# Altium schematic sheet 1_Comb_Generator_Sch.SchDoc
size A4; SheetNumber: 2; SheetTotal: 4; SPICEModelCacheYMJCRCOB: <root> / <DocumentId>YMJCRCOB</DocumentId> / </root>
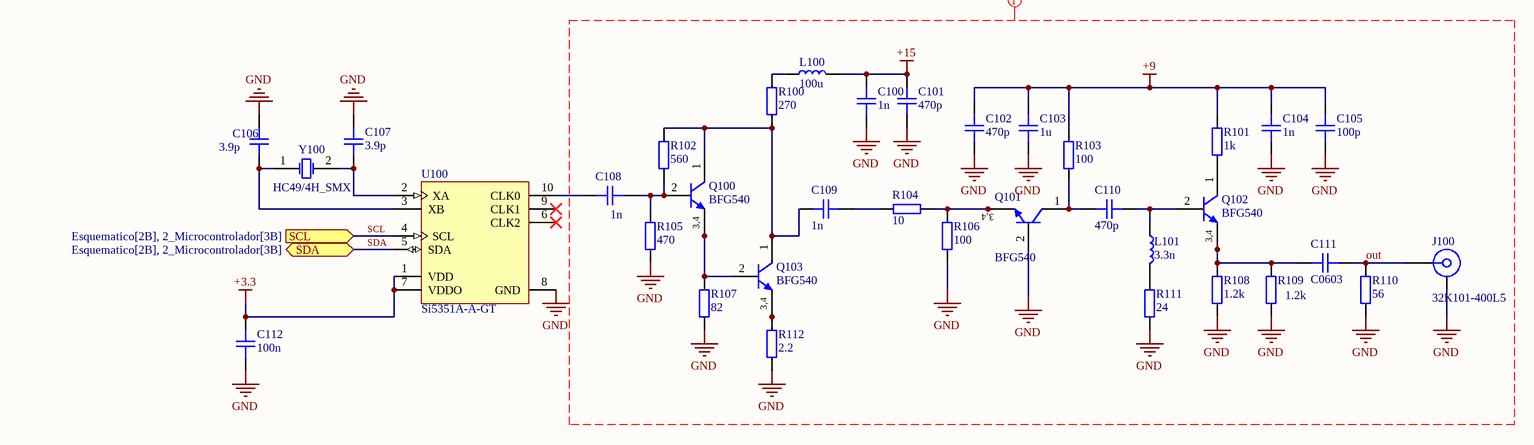
[diagram p0: 1_Comb_Generator_Sch.SchDoc]

## Parts
C100  1n  [CAP_0603]
C101  470p  [CAP_0603]
C102  470p  [CAP_0603]
C103  1u  [CAP_0603]
C104  1n  [CAP_0603]
C105  100p  [CAP_0603]
C106  3.9p  [CAP_0603]
C107  3.9p  [CAP_0603]
C108  1n  [CAP_0603]
C109  1n  [CAP_0603]
C110  470p  [CAP_0603]
C111  C0603  [CAP_0603]
C112  100n  [CAP_0603]
J100  32K101-400L5  [ROS-32K101-400L5_V]
L100  100u  [IND_0603]
L101  3.3n  [IND_0603]
Q100  BFG540  [SOT143B_N]
Q101  BFG540  [SOT143B_N]
Q102  BFG540  [SOT143B_N]
Q103  BFG540  [SOT143B_N]
R100  270  [RES_0603]
R101  1k  [RES_0603]
R102  560  [RES_0603]
R103  100  [RES_0603]
R104  10  [RES_0603]
R105  470  [RES_0603]
R106  100  [RES_0603]
R107  82  [RES_0603]
R108  1.2k  [RES_0603]
R109  1.2k  [RES_0603]
R110  56  [RES_0603]
R111  24  [RES_0603]
R112  2.2  [RES_0603]
U100  Si5351A-A-GT  [SLAB-MSOP-10_N]
Y100  HC49/4H_SMX  [HC49/4H_SMX]

## Ports
SCL (in, see Esquematico[2B], 2_Microcontrolador[3B]), SDA (bidir, see Esquematico[2B], 2_Microcontrolador[3B])

## Nets
+3.3: C112.1 U100.1(VDD) U100.7(VDDO)
+9: C102.1 C103.1 C104.1 C105.1 R101.2 R103.2
+15: C100.1 C101.1 L100.1
GND: C100.2 C101.2 C102.2 C103.2 C104.2 C105.2 C106.2 C107.2 C112.2 J100.MH Q101.2(B) R105.1 R106.1 R107.1 R108.1 R109.1 R110.1 R111.1 R112.1 U100.8(GND)
out: C111.2 J100.1 R110.2
SCL: U100.4(SCL) ; port SCL
SDA: U100.5(SDA) ; port SDA
NetC106_1: C106.1 U100.3(XB) Y100.1(OSC1)
NetC107_1: C107.1 U100.2(XA) Y100.2(OSC2)
NetC108_1: C108.1 Q100.2(B) R102.1 R105.2
NetC108_2: C108.2 U100.10(CLK0)
NetC109_1: C109.1 Q100.1(C) Q103.1(C) R100.1 R102.2
NetC109_2: C109.2 R104.2
NetC110_1: C110.1 L101.1 Q102.2(B)
NetC110_2: C110.2 Q101.1(C) R103.1
NetC111_1: C111.1 Q102.3(E) Q102.4(E) R108.2 R109.2
NetL100_2: L100.2 R100.2
NetL101_2: L101.2 R111.2
NetQ100_3: Q100.3(E) Q100.4(E) Q103.2(B) R107.2
NetQ101_3: Q101.3(E) Q101.4(E) R104.1 R106.2
NetQ102_1: Q102.1(C) R101.1
NetQ103_3: Q103.3(E) Q103.4(E) R112.2

Not connected (* = marked no-connect by the designer): U100 6(CLK2)* 9(CLK1)*

## Layout directives
net class RF_IMPEDANCE: +9, +15, GND, out

## Notes on the sheet
- (in symbol BFG540) 3,4

## Library data of the parts
C100-C112 = CAP_0603: Capacitor SMD 0603; Manufacturer: *; Manufacturer Part Number: *; Distributor Link: *; LCSC: *; Rating: *; Dielectric: *
J100 = CMP-0751-00001-1: SMA Straight Jack, Up to 18 GHz, -55 to 155 degC; Manufacturer: Rosenberger; Design Note: Footprint in library is a generic example - only application specific footprint delivers High Performance; PartNumber: 32K101-400L5; PackageDescription: SMA Straight Jack, 6.35 x 6.35 x 9.5 mm; ComponentLink5URL: http://www.rosenberger.com/en/contact/sales/; DatasheetVersion: a00; ComponentLink3URL: http://rosenberger.de/ok/images/documents/db/32K101-400L5.pdf; ComponentLink4Description: Series Overview / Design Note; ComponentLink5Description: Webshop / RFQ; PackageReference: 32K101-400L5; ComponentLink2Description: Datasheet; PackageVersion: a00; ComponentLink1Description: Manufacturer URL; ComponentLink3Description: Package Specification; ComponentLink2URL: http://rosenberger.de/ok/images/documents/db/32K101-400L5.pdf; Mounting Technology: Through Hole; ComponentLink1URL: http://www.rosenberger.de; ComponentLink4URL: http://rosenberger.de/ok/images/documents/spez/32.pdf
L100 L101 = IND_0603: Inductor SMD 0603
Q100-Q103 = BFG540: NPN 9 GHz Wideband Transistor; Published: 17-Sep-2003; LatestRevisionDate: 12-Dec-2006; LatestRevisionNote: IPC-7351 Footprint Added.; DatasheetVersion: 23-May-2000; PackageVersion: Oct-2001; PackageReference: SOT143B; Publisher: Altium Limited; PackageDescription: 4-Pin SOT-143 Package 1.9 mm Pitch, 2.3 mm Lead Span; ComponentLink1Description: Manufacturer Link; ComponentLink1URL: http://www.semiconductors.philips.com/; ComponentLink2Description: Datasheet; ComponentLink2URL: http://www.semiconductors.philips.com/acrobat/datasheets/BFG540_X_XR_4.pdf
R100-R112 = RES_0603: Resistor SMD 0603; Manufacturer: *; Manufacturer Part Number: *; Distributor Link: *; LCSC: *
U100 = Si5351A-A-GT: I2C-Programmable Any-Frequency CMOS Clock Generator + VCXO, 2.5 / 3.3 V, 0.008 to 160 MHz Output, -40 to 85 degC, 10-pin SOP; Manufacturer: Silicon Labs; Output Format: LVCMOS; Reference Inputs: 1; VDD: 2.5 V; 3.3 V; Sub-Family: Clock Generators; DatasheetVersion: Rev. 0.95; PackageReference: MSOP-10; PackageDescription: 10-Pin Mini Small Outline Package, Body 3 x 3 mm, Pitch 0.5 mm; Supplier 1: Digi-Key; Supplier Part Number 1: 336-1994-5-ND; Supplier 2: Mouser; Supplier Part Number 2: 634-SI5351A-A-GT; Output Frequency (MHz): 0.008 to 160; Mounting Technology: Surface Mount; Code_JEDEC: MO-187; Code_IPC: J-STD-020; PartNumber: Si5351A-A-GT; ComponentLink1Description: Manufacturer URL; ComponentLink1URL: http://www.silabs.com/; ComponentLink2Description: Datasheet; ComponentLink2URL: http://www.silabs.com/Support%20Documents/TechnicalDocs/Si5351.pdf; ComponentLink3Description: Package Specification; ComponentLink3URL: http://www.silabs.com/Support Documents/TechnicalDocs/C8051T60x.pdf
Y100 = HC49/4H_SMX: Surface Mount Quartz Crystal; Note: PCB layout complies with manufacturer's recommendation.; Published: 17-Jul-2002; DatasheetDocument: 18-Oct-1999; PackageDocument: 18-Oct-1999; PackageReference: HC49/4H_SMX; Publisher: Altium Limited; ComponentLink1Description: Manufacturer Link; ComponentLink1URL: http://www.cmac.com/mt/; ComponentLink2Description: Datasheet; ComponentLink2URL: http://www.cmac.com/mt/databook/crystals/smd/hc49_4h_smx.pdf